# Altium schematic sheet NB3000_USB_WiFi_MSD_Webserver.SchDoc
size B; DocumentNumber: 1; SheetNumber: 1; SheetTotal: 1
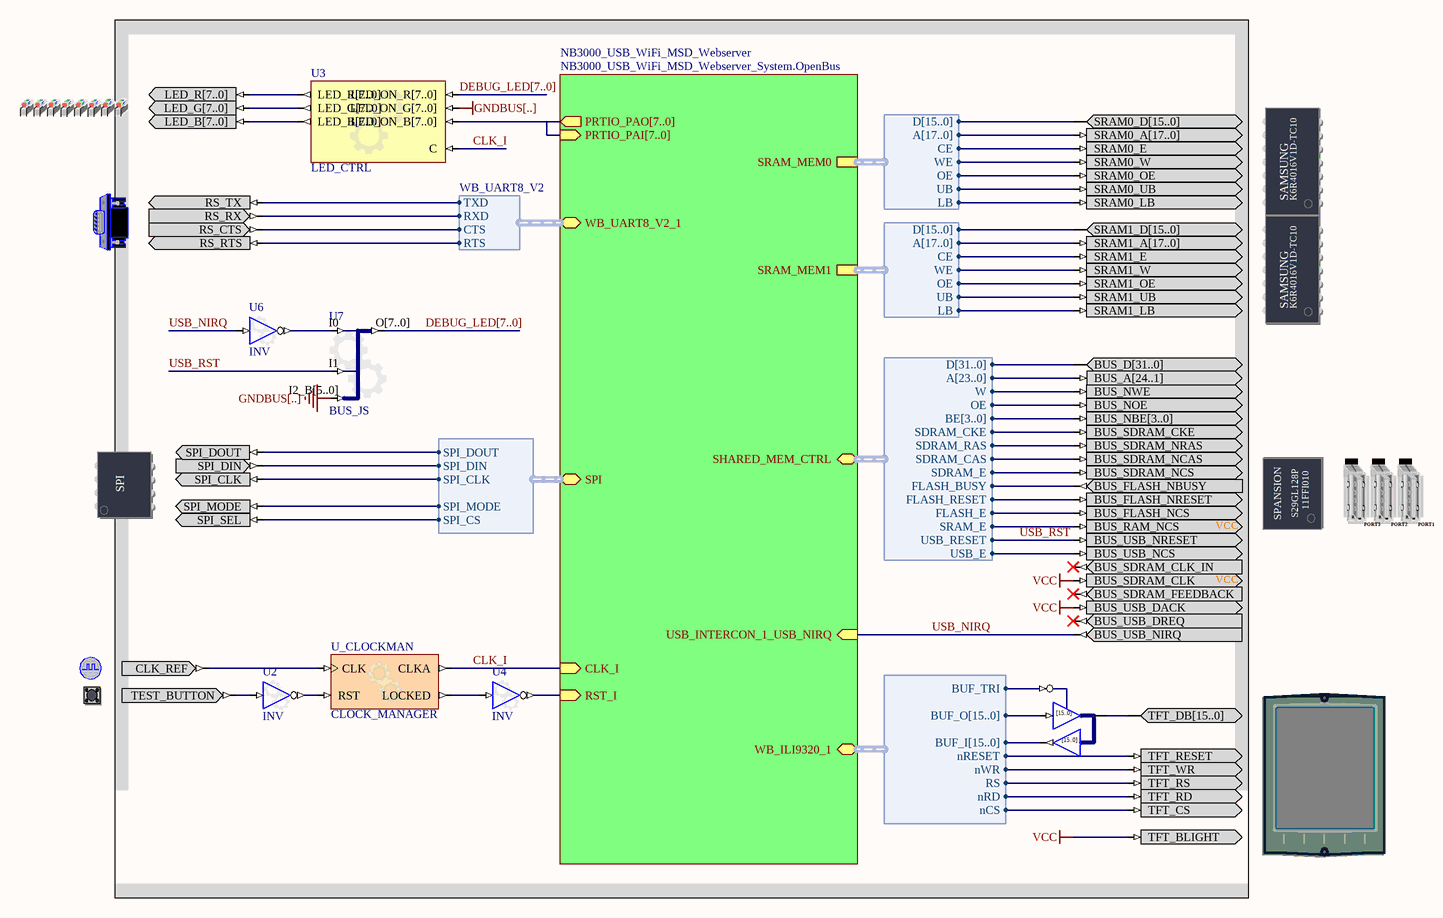
[diagram p0: NB3000_USB_WiFi_MSD_Webserver.SchDoc]

## Parts
(Parts that share a designator on the sheet are numbered #1, #2 ... from top to bottom, then left to right.)
?#1  LEDS_RGB  (value not drawn)
?#2  SRAM_DAUGHTER0  (value not drawn)
?#3  RS232CNTR  (value not drawn)
?#4  SRAM_DAUGHTER1  (value not drawn)
?#5  SHARED_FLASH_USB  (value not drawn)
?#6  SERIALFMEMORY  (value not drawn)
?#7  CLOCK_REFERENCE  (value not drawn)
?#8  TEST_BUTTON  (value not drawn)
?#9  TFT_LCD  (value not drawn)
U1  IOBUF16B  (value not drawn)
U2  INV
U3  LED_CTRL
U4  INV
U6  INV
U7  BUS_JS
U_CLOCKMAN  CLOCK_MANAGER

## Sub-sheets
NB3000_USB_WiFi_MSD_Webserver = NB3000_USB_WiFi_MSD_Webserver_System.OpenBus: SRAM_MEM0 (harness WB_MEM_CTRL_SRAM16_A18), SRAM_MEM1 (harness WB_MEM_CTRL_SRAM16_A18), RST_I (in), CLK_I (in), SHARED_MEM_CTRL (harness WB_SHARED_MEM_CTRL), USB_INTERCON_1_USB_NIRQ (in), PRTIO_PAO[7..0] (out), PRTIO_PAI[7..0] (in), WB_UART8_V2_1 (harness WB_UART8_V2), SPI (harness SPI_W_NB), WB_ILI9320_1 (harness VGA32_ILI9320)

## Harnesses
WB_MEM_CTRL_SRAM16_A18: D[15..0], A[17..0], CE, WE, OE, UB, LB
WB_SHARED_MEM_CTRL: D[31..0], A[23..0], W, OE, BE[3..0], SDRAM_CKE, SDRAM_RAS, SDRAM_CAS, SDRAM_E, FLASH_BUSY, FLASH_RESET, FLASH_E, SRAM_E, USB_RESET, USB_E
WB_UART8_V2: TXD, RXD, CTS, RTS
SPI_W_NB: SPI_DOUT, SPI_DIN, SPI_CLK, SPI_MODE, SPI_CS
VGA32_ILI9320: BUF_TRI, BUF_O[15..0], BUF_I[15..0], nRESET, nWR, RS, nRD, nCS

## Nets
GNDBUS[..]: U3.LED_ON_G[7..0] U7.I2_B[5..0]
VCC: ?#5.BUS_SDRAM_CLK ?#5.BUS_USB_DACK ?#9.TFT_BLIGHT
CLK_I: U3.C U_CLOCKMAN.CLKA ; sheet NB3000_USB_WiFi_MSD_Webserver/CLK_I
DEBUG_LED[7..0]: U3.LED_ON_R[7..0] U7.O[7..0]
USB_NIRQ: ?#5.BUS_USB_NIRQ U6.I ; sheet NB3000_USB_WiFi_MSD_Webserver/USB_INTERCON_1_USB_NIRQ
USB_RST: ?#5.BUS_USB_NRESET U7.I1 ; sheet NB3000_USB_WiFi_MSD_Webserver/SHARED_MEM_CTRL.USB_RESET
Net?#1_LED_B[7..0]: ?#1.LED_B[7..0] U3.LED_B[7..0]
Net?#1_LED_G[7..0]: ?#1.LED_G[7..0] U3.LED_G[7..0]
Net?#1_LED_R[7..0]: ?#1.LED_R[7..0] U3.LED_R[7..0]
Net?#2_SRAM0_A[17..0]: ?#2.SRAM0_A[17..0] ; sheet NB3000_USB_WiFi_MSD_Webserver/SRAM_MEM0.A[17..0]
Net?#2_SRAM0_D[15..0]: ?#2.SRAM0_D[15..0] ; sheet NB3000_USB_WiFi_MSD_Webserver/SRAM_MEM0.D[15..0]
Net?#2_SRAM0_E: ?#2.SRAM0_E ; sheet NB3000_USB_WiFi_MSD_Webserver/SRAM_MEM0.CE
Net?#2_SRAM0_LB: ?#2.SRAM0_LB ; sheet NB3000_USB_WiFi_MSD_Webserver/SRAM_MEM0.LB
Net?#2_SRAM0_OE: ?#2.SRAM0_OE ; sheet NB3000_USB_WiFi_MSD_Webserver/SRAM_MEM0.OE
Net?#2_SRAM0_UB: ?#2.SRAM0_UB ; sheet NB3000_USB_WiFi_MSD_Webserver/SRAM_MEM0.UB
Net?#2_SRAM0_W: ?#2.SRAM0_W ; sheet NB3000_USB_WiFi_MSD_Webserver/SRAM_MEM0.WE
Net?#3_RS_CTS: ?#3.RS_CTS ; sheet NB3000_USB_WiFi_MSD_Webserver/WB_UART8_V2_1.CTS
Net?#3_RS_RTS: ?#3.RS_RTS ; sheet NB3000_USB_WiFi_MSD_Webserver/WB_UART8_V2_1.RTS
Net?#3_RS_RX: ?#3.RS_RX ; sheet NB3000_USB_WiFi_MSD_Webserver/WB_UART8_V2_1.RXD
Net?#3_RS_TX: ?#3.RS_TX ; sheet NB3000_USB_WiFi_MSD_Webserver/WB_UART8_V2_1.TXD
Net?#4_SRAM1_A[17..0]: ?#4.SRAM1_A[17..0] ; sheet NB3000_USB_WiFi_MSD_Webserver/SRAM_MEM1.A[17..0]
Net?#4_SRAM1_D[15..0]: ?#4.SRAM1_D[15..0] ; sheet NB3000_USB_WiFi_MSD_Webserver/SRAM_MEM1.D[15..0]
Net?#4_SRAM1_E: ?#4.SRAM1_E ; sheet NB3000_USB_WiFi_MSD_Webserver/SRAM_MEM1.CE
Net?#4_SRAM1_LB: ?#4.SRAM1_LB ; sheet NB3000_USB_WiFi_MSD_Webserver/SRAM_MEM1.LB
Net?#4_SRAM1_OE: ?#4.SRAM1_OE ; sheet NB3000_USB_WiFi_MSD_Webserver/SRAM_MEM1.OE
Net?#4_SRAM1_UB: ?#4.SRAM1_UB ; sheet NB3000_USB_WiFi_MSD_Webserver/SRAM_MEM1.UB
Net?#4_SRAM1_W: ?#4.SRAM1_W ; sheet NB3000_USB_WiFi_MSD_Webserver/SRAM_MEM1.WE
Net?#5_BUS_A[24..1]: ?#5.BUS_A[24..1] ; sheet NB3000_USB_WiFi_MSD_Webserver/SHARED_MEM_CTRL.A[23..0]
Net?#5_BUS_D[31..0]: ?#5.BUS_D[31..0] ; sheet NB3000_USB_WiFi_MSD_Webserver/SHARED_MEM_CTRL.D[31..0]
Net?#5_BUS_FLASH_NBUSY: ?#5.BUS_FLASH_NBUSY ; sheet NB3000_USB_WiFi_MSD_Webserver/SHARED_MEM_CTRL.FLASH_BUSY
Net?#5_BUS_FLASH_NCS: ?#5.BUS_FLASH_NCS ; sheet NB3000_USB_WiFi_MSD_Webserver/SHARED_MEM_CTRL.FLASH_E
Net?#5_BUS_FLASH_NRESET: ?#5.BUS_FLASH_NRESET ; sheet NB3000_USB_WiFi_MSD_Webserver/SHARED_MEM_CTRL.FLASH_RESET
Net?#5_BUS_NBE[3..0]: ?#5.BUS_NBE[3..0] ; sheet NB3000_USB_WiFi_MSD_Webserver/SHARED_MEM_CTRL.BE[3..0]
Net?#5_BUS_NOE: ?#5.BUS_NOE ; sheet NB3000_USB_WiFi_MSD_Webserver/SHARED_MEM_CTRL.OE
Net?#5_BUS_NWE: ?#5.BUS_NWE ; sheet NB3000_USB_WiFi_MSD_Webserver/SHARED_MEM_CTRL.W
Net?#5_BUS_RAM_NCS: ?#5.BUS_RAM_NCS ; sheet NB3000_USB_WiFi_MSD_Webserver/SHARED_MEM_CTRL.SRAM_E
Net?#5_BUS_SDRAM_CKE: ?#5.BUS_SDRAM_CKE ; sheet NB3000_USB_WiFi_MSD_Webserver/SHARED_MEM_CTRL.SDRAM_CKE
Net?#5_BUS_SDRAM_NCAS: ?#5.BUS_SDRAM_NCAS ; sheet NB3000_USB_WiFi_MSD_Webserver/SHARED_MEM_CTRL.SDRAM_CAS
Net?#5_BUS_SDRAM_NCS: ?#5.BUS_SDRAM_NCS ; sheet NB3000_USB_WiFi_MSD_Webserver/SHARED_MEM_CTRL.SDRAM_E
Net?#5_BUS_SDRAM_NRAS: ?#5.BUS_SDRAM_NRAS ; sheet NB3000_USB_WiFi_MSD_Webserver/SHARED_MEM_CTRL.SDRAM_RAS
Net?#5_BUS_USB_NCS: ?#5.BUS_USB_NCS ; sheet NB3000_USB_WiFi_MSD_Webserver/SHARED_MEM_CTRL.USB_E
Net?#6_SPI_CLK: ?#6.SPI_CLK ; sheet NB3000_USB_WiFi_MSD_Webserver/SPI.SPI_CLK
Net?#6_SPI_DIN: ?#6.SPI_DIN ; sheet NB3000_USB_WiFi_MSD_Webserver/SPI.SPI_DIN
Net?#6_SPI_DOUT: ?#6.SPI_DOUT ; sheet NB3000_USB_WiFi_MSD_Webserver/SPI.SPI_DOUT
Net?#6_SPI_MODE: ?#6.SPI_MODE ; sheet NB3000_USB_WiFi_MSD_Webserver/SPI.SPI_MODE
Net?#6_SPI_SEL: ?#6.SPI_SEL ; sheet NB3000_USB_WiFi_MSD_Webserver/SPI.SPI_CS
Net?#7_CLK_REF: ?#7.CLK_REF U_CLOCKMAN.CLK
Net?#8_TEST_BUTTON: ?#8.TEST_BUTTON U2.I
Net?#9_TFT_CS: ?#9.TFT_CS ; sheet NB3000_USB_WiFi_MSD_Webserver/WB_ILI9320_1.nCS
Net?#9_TFT_DB[15..0]: ?#9.TFT_DB[15..0] U1.IO[15..0]
Net?#9_TFT_RD: ?#9.TFT_RD ; sheet NB3000_USB_WiFi_MSD_Webserver/WB_ILI9320_1.nRD
Net?#9_TFT_RESET: ?#9.TFT_RESET ; sheet NB3000_USB_WiFi_MSD_Webserver/WB_ILI9320_1.nRESET
Net?#9_TFT_RS: ?#9.TFT_RS ; sheet NB3000_USB_WiFi_MSD_Webserver/WB_ILI9320_1.RS
Net?#9_TFT_WR: ?#9.TFT_WR ; sheet NB3000_USB_WiFi_MSD_Webserver/WB_ILI9320_1.nWR
NetU1_I[15..0]: U1.I[15..0] ; sheet NB3000_USB_WiFi_MSD_Webserver/WB_ILI9320_1.BUF_O[15..0]
NetU1_O[15..0]: U1.O[15..0] ; sheet NB3000_USB_WiFi_MSD_Webserver/WB_ILI9320_1.BUF_I[15..0]
NetU1_T: U1.T ; sheet NB3000_USB_WiFi_MSD_Webserver/WB_ILI9320_1.BUF_TRI
NetU2_O: U2.O U_CLOCKMAN.RST
NetU3_LED_ON_B[7..0]: U3.LED_ON_B[7..0] ; sheet NB3000_USB_WiFi_MSD_Webserver/PRTIO_PAO[7..0], sheet NB3000_USB_WiFi_MSD_Webserver/PRTIO_PAI[7..0]
NetU4_I: U4.I U_CLOCKMAN.LOCKED
NetU4_O: U4.O ; sheet NB3000_USB_WiFi_MSD_Webserver/RST_I
NetU6_O: U6.O U7.I0

Not connected (* = marked no-connect by the designer): ?#5 BUS_SDRAM_CLK_IN* BUS_SDRAM_FEEDBACK* BUS_USB_DREQ*

## Buses and harness runs
bus DEBUG_LED[7..0]
bus sheet NB3000_USB_WiFi_MSD_Webserver/PRTIO_PAI[7..0] = sheet NB3000_USB_WiFi_MSD_Webserver/PRTIO_PAO[7..0]

## Notes on the sheet
- Title
- Size:
- Date:
- B
- Number:
- Time:
- Revision:
- Sheet
- of
- File:
- (in symbol IOBUF16B) [15..0]
- (in symbol SHARED_FLASH_USB) USB2; 11FFI010; SPANSION; S29GL128P; PORT3; PORT2; PORT1; VCC
- (in symbol SPI_BUS) SPI
- (in symbol SRAM_DAUGHTER0) SAMSUNG; K6R4016V1D-TC10
- (in symbol SRAM_DAUGHTER1) SAMSUNG; K6R4016V1D-TC10

## Library data of the parts
?#1 = LEDS_RGB: LEDS RGB; PortComponent: True; Published: 11-Mar-2009; Publisher: Altium Limited; HelpURL: https://wiki.altium.com/display/ADOH/NanoBoard+3000+-+RGB+User+LEDs
?#2 = SRAM_DAUGHTER0: Free Static RAM - Daughterboard; PortComponent: True; Published: 14-May-2007; Publisher: Altium Limited; HelpURL: TR0149 Technical Reference for Altium's Xilinx Spartan-3 Daughter Board DB30.pdf#page=16
?#3 = RS232CNTR: DCE Serial Port Connector; PortComponent: True; Published: 19-Nov-2003; Publisher: Altium Limited; HelpURL: https://wiki.altium.com/display/ADOH/NanoBoard+3000+-+RS-232+Serial+Interface
?#4 = SRAM_DAUGHTER1: Free Static RAM - Daughterboard; PortComponent: True; Published: 14-May-2007; Publisher: Altium Limited; HelpURL: TR0149 Technical Reference for Altium's Xilinx Spartan-3 Daughter Board DB30.pdf#page=16
?#5 = SHARED_FLASH_USB: Common-Bus Flash USB; PortComponent: True; Published: 14-May-2007; Publisher: Altium Limited; HelpURL: TR0149 Technical Reference for Altium's Xilinx Spartan-3 Daughter Board DB30.pdf#page=14
?#6 = SPI_BUS: Serial SPI Flash RAM; PortComponent: True; Published: 19-Nov-2003; Publisher: Altium Limited; HelpURL: https://wiki.altium.com/display/ADOH/Using+Multiple+SPI+and+I2C+Devices+in+a+Design; UseInDSF: True
?#7 = CLOCK_REFERENCE: Global System Clock Reference Supply; PortComponent: True; Published: 19-Nov-2003; Publisher: Altium Limited; HelpURL: https://wiki.altium.com/display/ADOH/NanoBoard+3000+-+System+Clocks
?#8 = TEST_BUTTON: Test / Reset Button; PortComponent: True; Published: 19-Nov-2003; Publisher: Altium Limited; HelpURL: TR0143 Technical Reference Manual for Altium's Desktop NanoBoard NB2DSK01.pdf#page=53
?#9 = TFT_LCD: TFT LCD Panel; PortComponent: True; Published: 22-Jan-2007; Publisher: Altium Limited; HelpURL: https://wiki.altium.com/display/ADOH/NanoBoard+3000+-+TFT+LCD+Panel+%28with+Touch+Screen%29
U1 = IOBUF16B: 16-Bit Input/Output Buffer, Bus Version; SubClass: IOBUF; Enable: Low; Control: Common Control T; PortSize: 16; ArchiveName: GENERIC; VHDLIB_SIM: GENERIC_LIB; Published: 29-Jan-2004; Publisher: Altium Limited; LastRevisionNo: 1.00.00; HelpURL: CR0118 FPGA Generic Library Guide.pdf#page=293; ComponentLink1URL: CR0125 FPGA Buffer Resource Usage.pdf#page=91; ComponentLink1Description: Core &Resource Usage; FunctionalClass: Buffer; PortStyle: Bus Version
U2 U4 = INV: Configurable Inverter; ConfigurationParameters: {}Version[1.1]{}SignalCount[1]{}SignalWidth0[1]{}OutputOption0[Inverted]{}EnableMode[None]{}ShowPinNames[False]{}; ConfiguratorName: GENERIC_BUFFER; LastRevisionNo: 1.00.00; Published: 10-Oct-2008; Publisher: Altium Limited; HelpURL: https://wiki.altium.com/display/ADOH/Configurable+Generic+Library
U3 = LED_CTRL: Configurable LED Controller; ConfigurationParameters: {}Version[1.0]{}NumLEDs[8]{}IntensityControl[Constant]{}ConstantIntensity[10]{}BusEnOut[True]{}IsRGB[True]{}; LastRevisionNo: 1.00.00; Published: 27-Apr-2009; Publisher: Altium Limited; ConfiguratorName: LED_CTRL
U6 = INV: Configurable Inverter; ConfiguratorName: GENERIC_BUFFER; ConfigurationParameters: {}Version[1.1]{}SignalCount[1]{}SignalWidth0[1]{}OutputOption0[Inverted]{}EnableMode[None]{}ShowPinNames[False]{}; LastRevisionNo: 1.00.00; Published: 19-Sep-2008; Publisher: Altium Limited; HelpURL: https://wiki.altium.com/display/ADOH/Configurable+Generic+Library
U7 = BUS_JS: Configurable Bus Joiner/Splitter; ConfiguratorName: GENERIC_BUS_JS; ConfigurationParameters: {}Version[1.1]{}SplitterJoinerType[Joiner]{}SignalCount[3]{}SignalWidth0[1]{}GapBelow0[3000000]{}ConnectionType0[Pin]{}SignalWidth1[1]{}GapBelow1[2000000]{}ConnectionType1[Pin]{}SignalWidth2[6]{}GapBelow2[1000000]{}ConnectionType2[Pin]{}ShowPinNames[True]{}; LastRevisionNo: 1.00.00; Published: 17-Sep-2008; Publisher: Altium Limited; HelpURL: https://wiki.altium.com/display/ADOH/Configurable+Generic+Library
U_CLOCKMAN = CLOCKMANAGER: Configurable Clock Manager; ConfiguratorName: GENERIC_CLOCKMANAGER; ConfigurationParameters: {}Version[1.0]{}Option_Configuration[object _1: TClockManagerPersist / VersionMajor [ 0 / VersionMinor [ 0 / InputFreq [ 20.000000000000000000 / InputName [ 'CLK' / OutputTargets [ < / item / Name [ 'CLKA' / OutFreqMin [ 40.000000000000000000 / OutFreqMax [ 40.000000000000000000 / OutPostDivider [ 1.000000000000000000 / end> / OutputDevices [ < / item / Name [ 'Spartan3AN' / Valid [ True / OutputActuals [ < / item / Name [ 'CLK0' / Multipler [ 1.000000000000000000 / Divider [ 1.000000000000000000 / OutFreq [ 20.000000000000000000 / OutputMap [ 1 / end / item / Name [ 'CLK90' / Multipler [ 1.000000000000000000 / Divider [ 1.000000000000000000 / OutPhase [ 90.000000000000000000 / OutFreq [ 20.000000000000000000 / OutputMap [ 2 / end / item / Name [ 'CLK180' / Multipler [ 1.000000000000000000 / Divider [ 1.000000000000000000 / OutPhase [ 180.000000000000000000 / OutFreq [ 20.000000000000000000 / OutputMap [ 3 / end / item / Name [ 'CLK270' / Multipler [ 1.000000000000000000 / Divider [ 1.000000000000000000 / OutPhase [ 270.000000000000000000 / OutFreq [ 20.000000000000000000 / OutputMap [ 4 / end / item / Name [ 'CLK2X' / Multipler [ 2.000000000000000000 / Divider [ 1.000000000000000000 / OutFreq [ 40.000000000000000000 / OutputMap [ 0 / end / item / Name [ 'CLKDV' / Multipler [ 1.000000000000000000 / Divider [ 2.000000000000000000 / OutFreq [ 10.000000000000000000 / OutputMap [ 5 / end / item / Name [ 'CLK2X180' / Multipler [ 1.000000000000000000 / Divider [ 1.000000000000000000 / OutPhase [ 180.000000000000000000 / OutFreq [ 40.000000000000000000 / OutputMap [ 6 / end / item / Name [ 'CLKFX' / Multipler [ 2.000000000000000000 / Divider [ 1.000000000000000000 / OutFreq [ 40.000000000000000000 / OutputMap [ 7 / end / item / Name [ 'CLKFX180' / Multipler [ 1.000000000000000000 / Divider [ 1.000000000000000000 / OutPhase [ 180.000000000000000000 / OutFreq [ 40.000000000000000000 / OutputMap [ 8 / end> / InternalActuals [ <> / CustomVars [ <> / end / item / Name [ 'Cyclone3' / Valid [ True / OutputActuals [ < / item / Name [ 'C0' / Multipler [ 2.000000000000000000 / Divider [ 1.000000000000000000 / OutFreq [ 40.000000000000000000 / OutputMap [ 0 / end / item / Name [ 'C1' / Multipler [ 1.000000000000000000 / Divider [ 1.000000000000000000 / OutFreq [ 20.000000000000000000 / OutputMap [ 1 / end / item / Name [ 'C2' / Multipler [ 1.000000000000000000 / Divider [ 1.000000000000000000 / OutFreq [ 20.000000000000000000 / OutputMap [ 2 / end / item / Name [ 'C3' / Multipler [ 1.000000000000000000 / Divider [ 1.000000000000000000 / OutFreq [ 20.000000000000000000 / OutputMap [ 3 / end / item / Name [ 'C4' / Multipler [ 1.000000000000000000 / Divider [ 1.000000000000000000 / OutFreq [ 20.000000000000000000 / OutputMap [ 4 / end> / InternalActuals [ <> / CustomVars [ <> / end> / MinInputFreq [ 1.000000000000000000 / MaxInputFreq [ 280.000000000000000000 / MinOutputFreq [ 18.000000000000000000 / MaxOutputFreq [ 210.000000000000000000 / MaxOutputCount [ 9 / end]{}; LastRevisionNo: 1.00.00; Published: 18-Feb-2009; Publisher: Altium Limited; HelpURL: https://wiki.altium.com/display/ADOH/New+Configurable+Generic+FPGA+Logic+Components